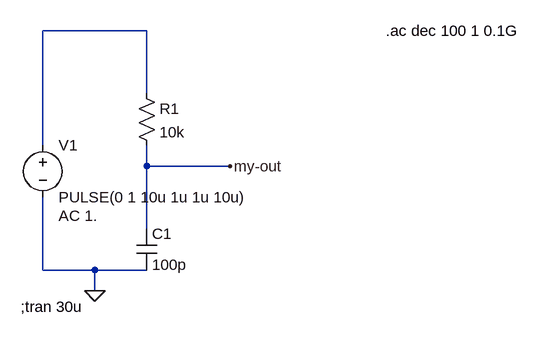
[diagram p0: schematic essai.asc]
essai.asc, the LTspice schematic file:
Version 4
SHEET 1 880 680
WIRE 176 -48 16 -48
WIRE 176 48 176 -48
WIRE 16 128 16 -48
WIRE 176 160 176 128
WIRE 304 160 176 160
WIRE 176 256 176 160
WIRE 16 320 16 208
WIRE 96 320 16 320
WIRE 176 320 96 320
WIRE 96 352 96 320
FLAG 96 352 0
FLAG 304 160 my-out
SYMBOL voltage 16 112 R0
WINDOW 123 24 124 Left 2
WINDOW 39 0 0 Left 0
SYMATTR InstName V1
SYMATTR Value PULSE(0 1 10u 1u 1u 10u)
SYMATTR Value2 AC 1.
SYMBOL res 160 32 R0
SYMATTR InstName R1
SYMATTR Value 10k
SYMBOL cap 160 256 R0
SYMATTR InstName C1
SYMATTR Value 100p
TEXT -18 376 Left 2 !;tran 30u
TEXT 544 -48 Left 2 !.ac dec 100 1 0.1G

The netlist it stands for:
* essai.asc
V1 N001 0 PULSE(0 1 10u 1u 1u 10u) AC 1.
R1 N001 my-out 10k
C1 my-out 0 100p
;tran 30u
.ac dec 100 1 0.1G
.backanno
.end